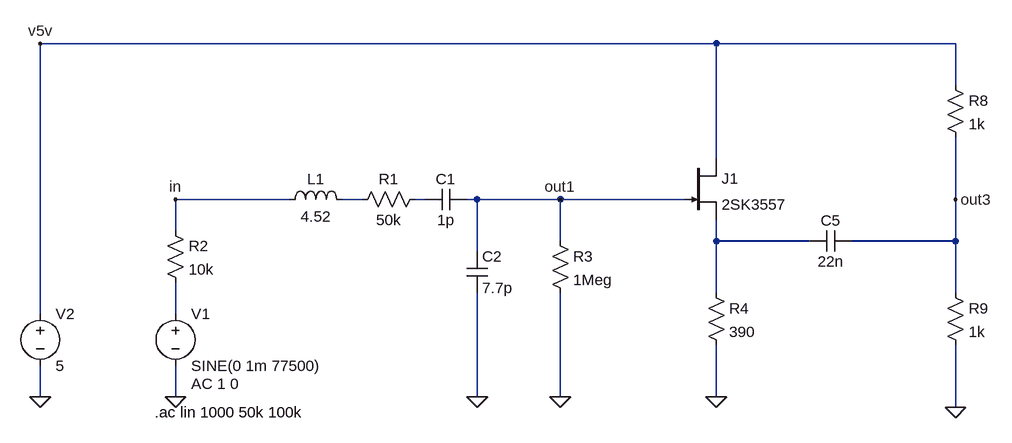
[diagram p0: schematic 02_Crystal_and_nFET_AC-analysis.asc]
02_Crystal_and_nFET_AC-analysis.asc, the LTspice schematic file:
Version 4
SHEET 1 1192 680
WIRE 704 -224 -336 -224
WIRE 1072 -224 704 -224
WIRE 1072 -160 1072 -224
WIRE 704 -48 704 -224
WIRE 48 16 -128 16
WIRE 160 16 128 16
WIRE 256 16 240 16
WIRE 336 16 320 16
WIRE 464 16 336 16
WIRE 656 16 464 16
WIRE 1072 16 1072 -80
WIRE -128 64 -128 16
WIRE 464 80 464 16
WIRE 704 80 704 48
WIRE 848 80 704 80
WIRE 1072 80 1072 16
WIRE 1072 80 912 80
WIRE 336 96 336 16
WIRE 704 160 704 80
WIRE 1072 160 1072 80
WIRE -336 192 -336 -224
WIRE -128 192 -128 144
WIRE -336 320 -336 272
WIRE -128 320 -128 272
WIRE 336 320 336 160
WIRE 464 320 464 160
WIRE 704 320 704 240
WIRE 1072 336 1072 240
FLAG -128 320 0
FLAG 464 320 0
FLAG 464 16 out1
FLAG -128 16 in
FLAG 336 320 0
FLAG 704 320 0
FLAG -336 320 0
FLAG -336 -224 v5v
FLAG 1072 336 0
FLAG 1072 16 out3
SYMBOL ind 32 32 R270
WINDOW 0 32 56 VTop 2
WINDOW 3 5 56 VBottom 2
SYMATTR InstName L1
SYMATTR Value 4.52
SYMBOL cap 320 0 R90
WINDOW 0 0 32 VBottom 2
WINDOW 3 32 32 VTop 2
SYMATTR InstName C1
SYMATTR Value 1p
SYMBOL res 256 0 R90
WINDOW 0 0 56 VBottom 2
WINDOW 3 32 56 VTop 2
SYMATTR InstName R1
SYMATTR Value 50k
SYMBOL voltage -128 176 R0
WINDOW 123 24 124 Left 2
WINDOW 39 0 0 Left 0
SYMATTR Value2 AC 1 0
SYMATTR InstName V1
SYMATTR Value SINE(0 1m 77500)
SYMBOL res -144 48 R0
SYMATTR InstName R2
SYMATTR Value 10k
SYMBOL res 448 64 R0
SYMATTR InstName R3
SYMATTR Value 1Meg
SYMBOL cap 320 96 R0
SYMATTR InstName C2
SYMATTR Value 7.7p
SYMBOL res 688 144 R0
SYMATTR InstName R4
SYMATTR Value 390
SYMBOL voltage -336 176 R0
WINDOW 123 0 0 Left 0
WINDOW 39 24 124 Left 2
SYMATTR InstName V2
SYMATTR Value 5
SYMBOL njf 656 -48 R0
SYMATTR InstName J1
SYMATTR Value 2SK3557
SYMBOL cap 912 64 R90
WINDOW 0 0 32 VBottom 2
WINDOW 3 32 32 VTop 2
SYMATTR InstName C5
SYMATTR Value 22n
SYMBOL res 1056 -176 R0
SYMATTR InstName R8
SYMATTR Value 1k
SYMBOL res 1056 144 R0
SYMATTR InstName R9
SYMATTR Value 1k
TEXT -160 344 Left 2 !.ac lin 1000 50k 100k

The netlist it stands for:
* 02_Crystal_and_nFET_AC-analysis.asc
L1 in N001 4.52
C1 out1 N002 1p
R1 N002 N001 50k
V1 N004 0 SINE(0 1m 77500) AC 1 0
R2 in N004 10k
R3 out1 0 1Meg
C2 out1 0 7.7p
R4 N003 0 390
V2 v5v 0 5
J1 v5v out1 N003 2SK3557
C5 out3 N003 22n
R8 v5v out3 1k
R9 out3 0 1k
.model NJF NJF
.model PJF PJF
.lib standard.jft
.ac lin 1000 50k 100k
.backanno
.end